# Altium schematic sheet MAIN2.SchDoc: Main Circuit
size 457 x 304 mm; DrawnBy: Daniel C. Salunga; SheetNumber: 1
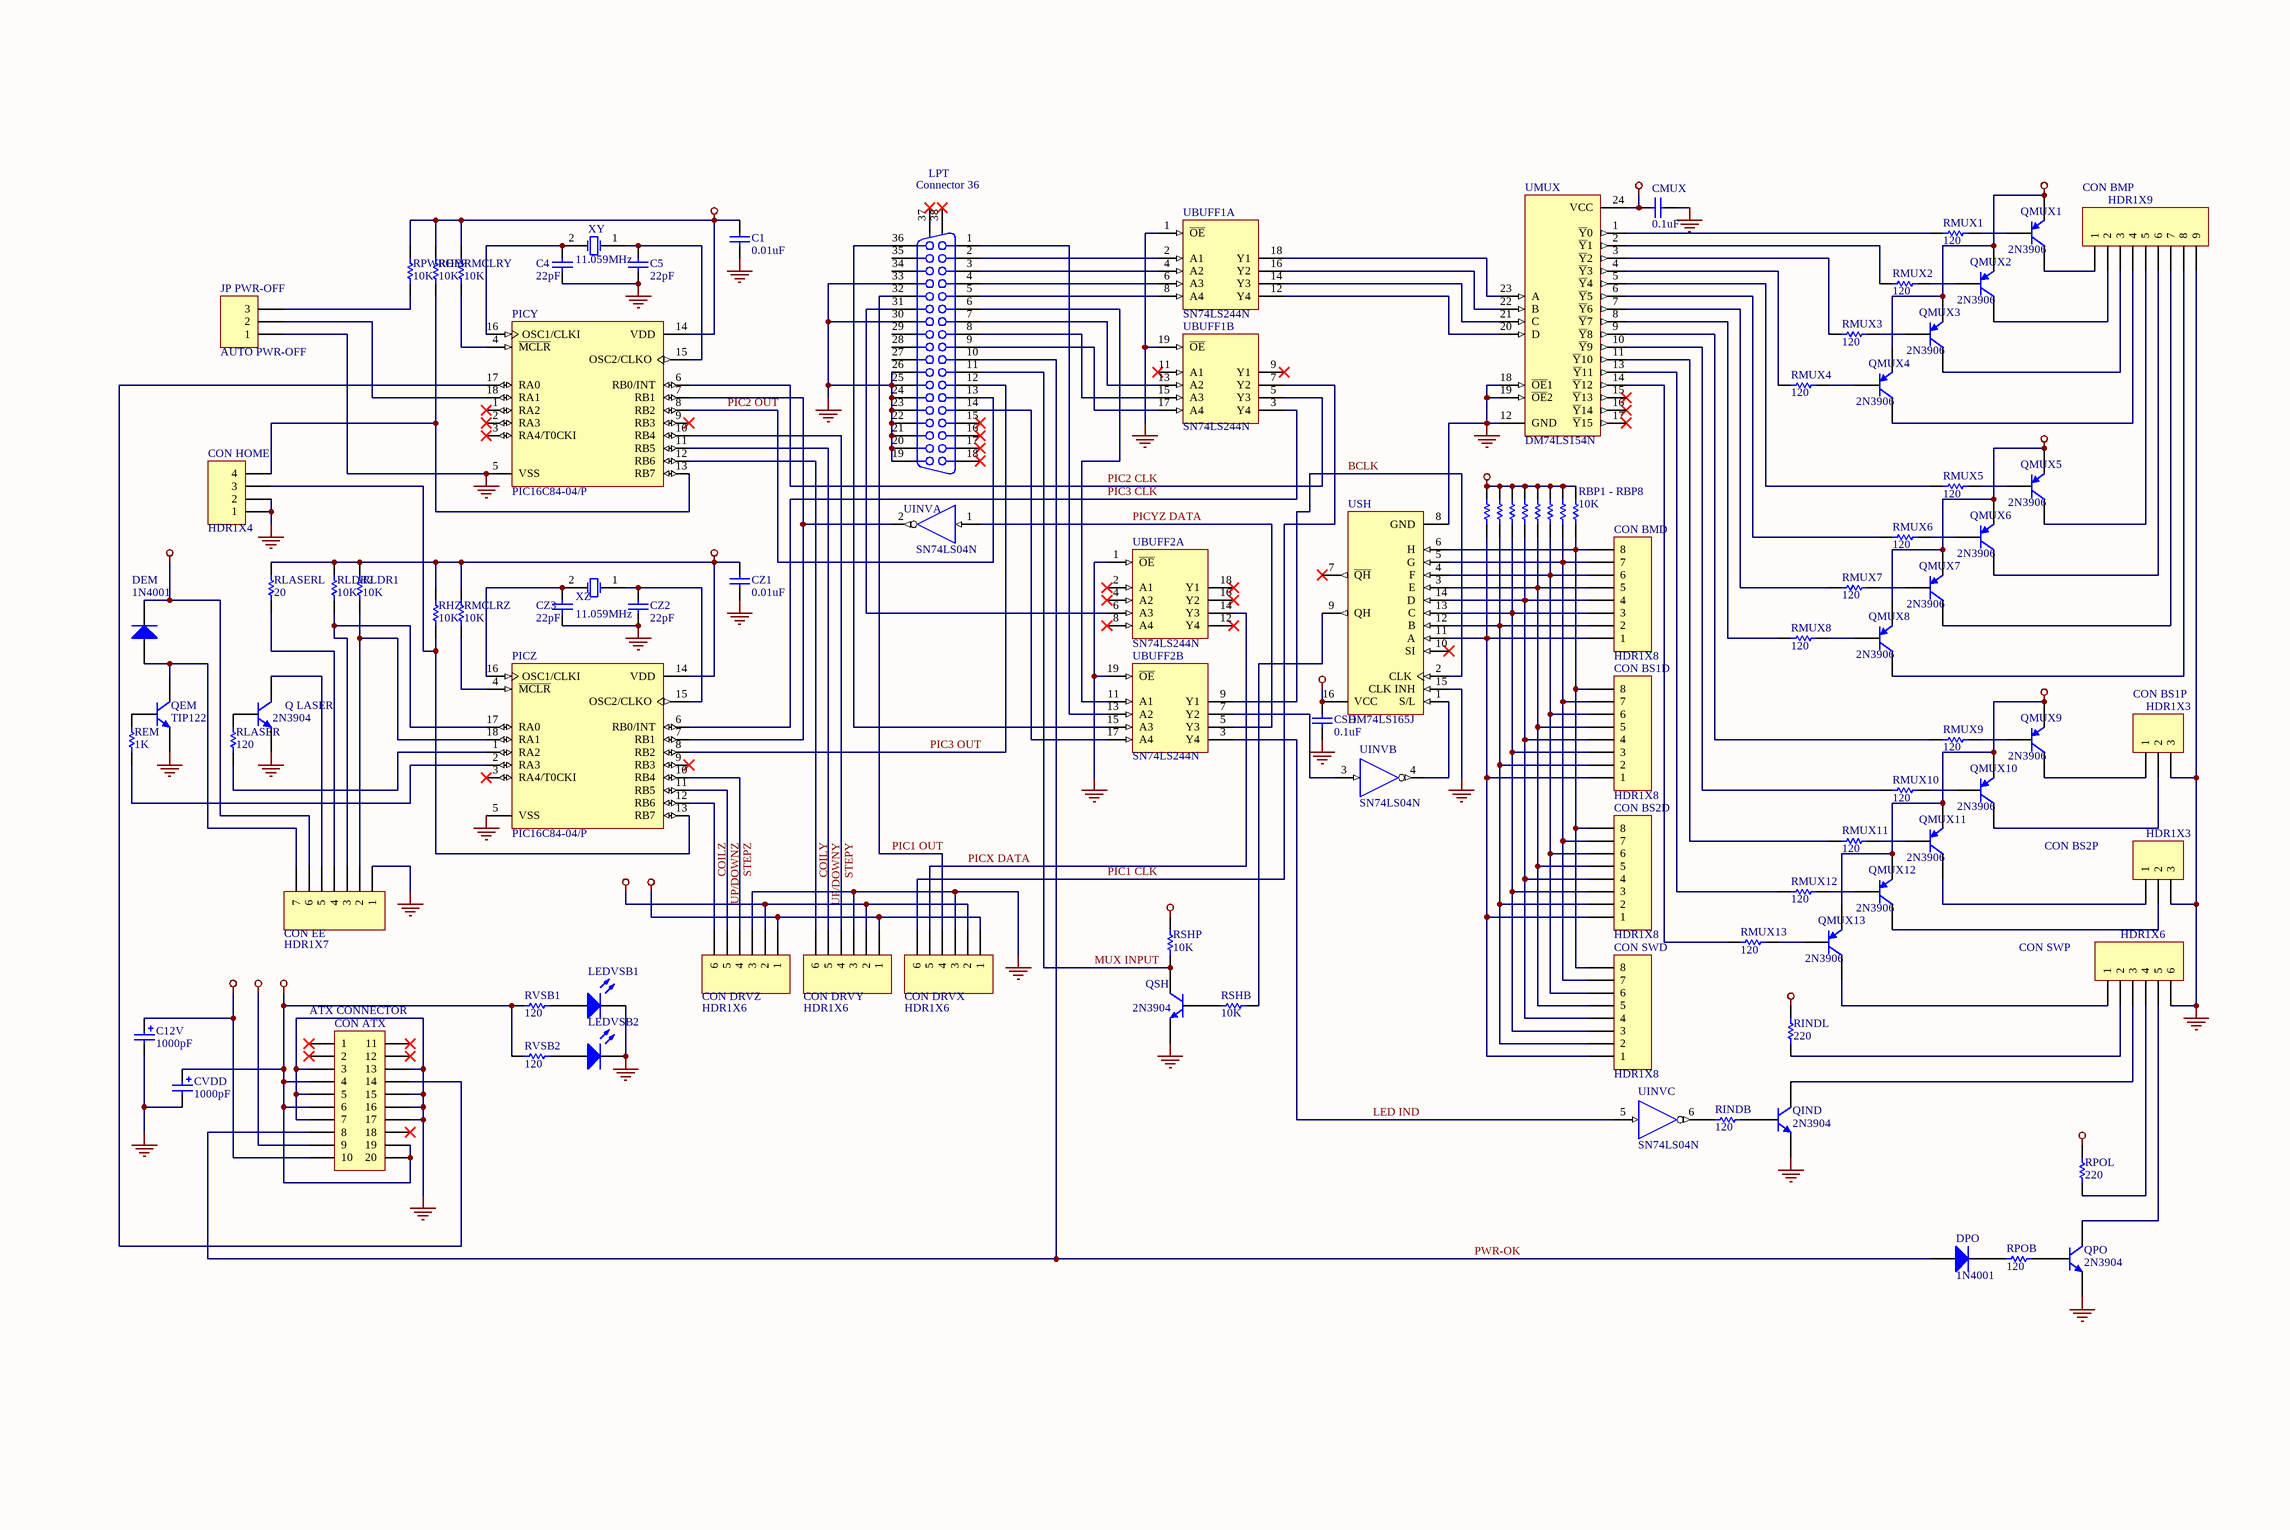
[diagram p0: MAIN2.SchDoc]

## Parts
C1  value 0.01uF  [C3216-1206]
C4  value 22pF  [C3216-1206]  (hidden comment: XTAL)
C5  value 22pF  [C3216-1206]  (hidden comment: XTAL)
C12V  value 1000pF  [RB5-10.5]
CMUX  value 0.1uF  [C3216-1206]
CON_ATX  ATX CONNECTOR  [HDR2X10_CEN]
CON_BMD  HDR1X8  [HDR1X8]
CON_BMP  HDR1X9  [HDR1X9]
CON_BS1D  HDR1X8  [HDR1X8]
CON_BS1P  HDR1X3  [HDR1X3]
CON_BS2D  HDR1X8  [HDR1X8]
CON_BS2P  HDR1X3  [HDR1X3]
CON_DRVX  HDR1X6  [HDR1X6]
CON_DRVY  HDR1X6  [HDR1X6]
CON_DRVZ  HDR1X6  [HDR1X6]
CON_EE  HDR1X7  [HDR1X7]
CON_HOME  HDR1X4  [HDR1X4]
CON_SWD  HDR1X8  [HDR1X8]
CON_SWP  HDR1X6  [HDR1X6]
CSH  value 0.1uF  [C3216-1206]
CVDD  value 1000pF  [RB5-10.5]
CZ1  value 0.01uF  [C3216-1206]
CZ2  value 22pF  [C3216-1206]  (hidden comment: XTAL)
CZ3  value 22pF  [C3216-1206]  (hidden comment: XTAL)
DEM  1N4001  [DIO10.46-5.3x2.8]
DPO  1N4001  [DIO10.46-5.3x2.8]
JP_PWR-OFF  AUTO PWR-OFF  [HDR1X3H]
LEDVSB1  (no value)  [DSO-F2/D6.1]
LEDVSB2  (no value)  [DSO-F2/D6.1]
LPT  Connector 36  [CHAMP1.27-2H36]
PICY  PIC16C84-04/P  [DIP-18]
PICZ  PIC16C84-04/P  [DIP-18]
Q_LASER  2N3904  [BCY-W3/D4.7]
QEM  TIP122  [SFM-T3/X1.6V]
QIND  2N3904  [BCY-W3/D4.7]
QMUX1  2N3906  [BCY-W3/D4.7]
QMUX2  2N3906  [BCY-W3/D4.7]
QMUX3  2N3906  [BCY-W3/D4.7]
QMUX4  2N3906  [BCY-W3/D4.7]
QMUX5  2N3906  [BCY-W3/D4.7]
QMUX6  2N3906  [BCY-W3/D4.7]
QMUX7  2N3906  [BCY-W3/D4.7]
QMUX8  2N3906  [BCY-W3/D4.7]
QMUX9  2N3906  [BCY-W3/D4.7]
QMUX10  2N3906  [BCY-W3/D4.7]
QMUX11  2N3906  [BCY-W3/D4.7]
QMUX12  2N3906  [BCY-W3/D4.7]
QMUX13  2N3906  [BCY-W3/D4.7]
QPO  2N3904  [BCY-W3]
QSH  2N3904  [BCY-W3/D4.7]
RBP1  Res1  [AXIAL-0.3]  (value not drawn)
RBP1_-_RBP8  value 10K  [AXIAL-0.3]  (hidden comment: Res1)
RBP2  Res1  [AXIAL-0.3]  (value not drawn)
RBP3  Res1  [AXIAL-0.3]  (value not drawn)
RBP4  Res1  [AXIAL-0.3]  (value not drawn)
RBP5  Res1  [AXIAL-0.3]  (value not drawn)
RBP6  Res1  [AXIAL-0.3]  (value not drawn)
RBP7  Res1  [AXIAL-0.3]  (value not drawn)
REM  value 1K  [AXIAL-0.3]
RHY  value 10K  [AXIAL-0.3]
RHZ  value 10K  [AXIAL-0.3]
RINDB  value 120  [AXIAL-0.3]
RINDL  value 220  [AXIAL-0.3]
RLASER  value 120  [AXIAL-0.3]
RLASERL  value 20  [AXIAL-0.3]
RLDR1  value 10K  [AXIAL-0.3]
RLDR2  value 10K  [AXIAL-0.3]
RMCLRY  value 10K  [AXIAL-0.3]
RMCLRZ  value 10K  [AXIAL-0.3]
RMUX1  value 120  [AXIAL-0.3]
RMUX2  value 120  [AXIAL-0.3]
RMUX3  value 120  [AXIAL-0.3]
RMUX4  value 120  [AXIAL-0.3]
RMUX5  value 120  [AXIAL-0.3]
RMUX6  value 120  [AXIAL-0.3]
RMUX7  value 120  [AXIAL-0.3]
RMUX8  value 120  [AXIAL-0.3]
RMUX9  value 120  [AXIAL-0.3]
RMUX10  value 120  [AXIAL-0.3]
RMUX11  value 120  [AXIAL-0.3]
RMUX12  value 120  [AXIAL-0.3]
RMUX13  value 120  [AXIAL-0.3]
RPOB  value 120  [AXIAL-0.3]
RPOL  value 220  [AXIAL-0.3]
RPWROFF  value 10K  [AXIAL-0.3]
RSHB  value 10K  [AXIAL-0.3]
RSHP  value 10K  [AXIAL-0.3]
RVSB1  value 120  [AXIAL-0.3]
RVSB2  value 120  [AXIAL-0.3]
UBUFF1  SN74LS244N  [DIP-20/E5.3]  (parts A,B of 2)
UBUFF2  SN74LS244N  [DIP-20/E5.3]  (parts A,B of 2)
UINV  SN74LS04N  [DIP-14/D19.7]  (parts A,B,C of 6)
UMUX  DM74LS154N  [DIP-24/D32.3]
USH  DM74LS165J  [DIP-16]
XY  11.059MHz  [BCY-W2/D3.1]
XZ  11.059MHz  [BCY-W2/D3.1]

## Nets
+12V: C12V.1 CON_ATX.10 CON_DRVX.1 CON_DRVY.1 CON_DRVZ.1 CON_EE.6 DEM.2(K)
GND: C1.1 C4.1 C5.1 C12V.2 CMUX.2 CON_ATX.3 CON_ATX.5 CON_ATX.7 CON_ATX.13 CON_ATX.15 CON_ATX.16 CON_ATX.17 CON_BMP.9 CON_BS1P.3 CON_BS2P.3 CON_DRVX.3 CON_DRVY.3 CON_DRVZ.3 CON_EE.1 CON_HOME.1 CON_HOME.2 CON_SWP.6 CSH.1 CVDD.2 CZ1.1 CZ2.1 CZ3.1 JP_PWR-OFF.1 LEDVSB1.2(K) LEDVSB2.2(K) LPT.19 LPT.20 LPT.21 LPT.22 LPT.23 LPT.24 LPT.25 LPT.26 LPT.30 LPT.33 PICY.5(VSS) PICZ.5(VSS) Q_LASER.1(E) QEM.3(E) QIND.1(E) QPO.3(E) QSH.1(E) UBUFF1.1(~{OE}) UBUFF1.10(GND) UBUFF1.19(~{OE}) UBUFF2.1(~{OE}) UBUFF2.10(GND) UBUFF2.19(~{OE}) UINV.7(GND) UMUX.12(GND) UMUX.18(~{OE}1) UMUX.19(~{OE}2) USH.8(GND) USH.15(CLK_INH)
VDD: CMUX.1 CON_ATX.4 CON_ATX.6 CON_ATX.19 CON_ATX.20 CON_DRVX.2 CON_DRVY.2 CON_DRVZ.2 CSH.2 CVDD.1 CZ1.2 PICZ.14(VDD) QMUX1.1(E) QMUX2.1(E) QMUX3.1(E) QMUX4.1(E) QMUX5.1(E) QMUX6.1(E) QMUX7.1(E) QMUX8.1(E) QMUX9.1(E) QMUX10.1(E) QMUX11.1(E) QMUX12.1(E) QMUX13.1(E) RBP1.2 RBP1_-_RBP8.2 RBP2.2 RBP3.2 RBP4.2 RBP5.2 RBP6.2 RBP7.2 RHZ.2 RINDL.2 RLASERL.2 RLDR1.2 RLDR2.2 RMCLRZ.2 RSHP.2 RVSB1.1 RVSB2.1 UBUFF1.20(VDD) UBUFF2.20(VDD) UINV.14(VDD) UMUX.24(VCC) USH.16(VCC)
VSB: C1.2 CON_ATX.9 PICY.14(VDD) RHY.2 RMCLRY.2 RPOL.2 RPWROFF.2
BCLK: UBUFF2.9(Y1) USH.2(CLK)
COILY: CON_DRVY.6 PICY.12(RB6)
COILZ: CON_DRVZ.6 PICZ.12(RB6)
LED IND: UBUFF2.3(Y4) UINV.5(IN)
MUX INPUT: LPT.11 QSH.3(C) RSHP.1
PIC1 CLK: CON_DRVX.6 UBUFF1.7(Y2)
PIC1 OUT: CON_DRVX.4 LPT.32
PIC2 CLK: PICY.6(RB0/INT) UBUFF1.5(Y3)
PIC2 OUT: LPT.13 PICY.8(RB2)
PIC3 CLK: PICZ.6(RB0/INT) UBUFF1.3(Y4)
PIC3 OUT: LPT.12 PICZ.8(RB2)
PICX DATA: CON_DRVX.5 UBUFF2.14(Y3)
PICYZ DATA: UBUFF2.5(Y3) UINV.1(IN)
PWR-OK: CON_ATX.8 DPO.1(A) LPT.10
STEPY: CON_DRVY.4 PICY.10(RB4)
STEPZ: CON_DRVZ.4 PICZ.10(RB4)
UP/DOWNY: CON_DRVY.5 PICY.11(RB5)
UP/DOWNZ: CON_DRVZ.5 PICZ.11(RB5)
NetC4_2: C4.2 PICY.16(OSC1/CLKI) XY.2(OSC2)
NetC5_2: C5.2 PICY.15(OSC2/CLKO) XY.1(OSC1)
NetCON_ATX_14: CON_ATX.14 PICY.17(RA0)
NetCON_BMD_1: CON_BMD.1 CON_BS1D.1 CON_BS2D.1 CON_SWD.1 RBP1.1 USH.11(A)
NetCON_BMD_2: CON_BMD.2 CON_BS1D.2 CON_BS2D.2 CON_SWD.2 RBP2.1 USH.12(B)
NetCON_BMD_3: CON_BMD.3 CON_BS1D.3 CON_BS2D.3 CON_SWD.3 RBP3.1 USH.13(C)
NetCON_BMD_4: CON_BMD.4 CON_BS1D.4 CON_BS2D.4 CON_SWD.4 RBP4.1 USH.14(D)
NetCON_BMD_5: CON_BMD.5 CON_BS1D.5 CON_BS2D.5 CON_SWD.5 RBP5.1 USH.3(E)
NetCON_BMD_6: CON_BMD.6 CON_BS1D.6 CON_BS2D.6 CON_SWD.6 RBP6.1 USH.4(F)
NetCON_BMD_7: CON_BMD.7 CON_BS1D.7 CON_BS2D.7 CON_SWD.7 RBP7.1 USH.5(G)
NetCON_BMD_8: CON_BMD.8 CON_BS1D.8 CON_BS2D.8 CON_SWD.8 RBP1_-_RBP8.1 USH.6(H)
NetCON_BMP_1: CON_BMP.1 QMUX1.3(C)
NetCON_BMP_2: CON_BMP.2 QMUX2.3(C)
NetCON_BMP_3: CON_BMP.3 QMUX3.3(C)
NetCON_BMP_4: CON_BMP.4 QMUX4.3(C)
NetCON_BMP_5: CON_BMP.5 QMUX5.3(C)
NetCON_BMP_6: CON_BMP.6 QMUX6.3(C)
NetCON_BMP_7: CON_BMP.7 QMUX7.3(C)
NetCON_BMP_8: CON_BMP.8 QMUX8.3(C)
NetCON_BS1P_1: CON_BS1P.1 QMUX9.3(C)
NetCON_BS1P_2: CON_BS1P.2 QMUX10.3(C)
NetCON_BS2P_1: CON_BS2P.1 QMUX11.3(C)
NetCON_BS2P_2: CON_BS2P.2 QMUX12.3(C)
NetCON_EE_2: CON_EE.2 PICZ.18(RA1) RLDR1.1
NetCON_EE_3: CON_EE.3 PICZ.17(RA0) RLDR2.1
NetCON_EE_4: CON_EE.4 RLASERL.1
NetCON_EE_5: CON_EE.5 Q_LASER.3(C)
NetCON_EE_7: CON_EE.7 DEM.1(A) QEM.2(C)
NetCON_HOME_3: CON_HOME.3 PICZ.13(RB7) RHZ.1
NetCON_HOME_4: CON_HOME.4 PICY.13(RB7) RHY.1
NetCON_SWP_1: CON_SWP.1 QMUX13.3(C)
NetCON_SWP_2: CON_SWP.2 RINDL.1
NetCON_SWP_3: CON_SWP.3 QIND.3(C)
NetCON_SWP_4: CON_SWP.4 RPOL.1
NetCON_SWP_5: CON_SWP.5 QPO.1(C)
NetCZ2_2: CZ2.2 PICZ.15(OSC2/CLKO) XZ.1(OSC1)
NetCZ3_2: CZ3.2 PICZ.16(OSC1/CLKI) XZ.2(OSC2)
NetDPO_2: DPO.2(K) RPOB.1
NetJP_PWR-OFF_2: JP_PWR-OFF.2 PICY.18(RA1)
NetJP_PWR-OFF_3: JP_PWR-OFF.3 RPWROFF.1
NetLEDVSB1_1: LEDVSB1.1(A) RVSB1.2
NetLEDVSB2_1: LEDVSB2.1(A) RVSB2.2
NetLPT_1: LPT.1 UBUFF2.13(A2)
NetLPT_2: LPT.2 UBUFF1.2(A1)
NetLPT_3: LPT.3 UBUFF1.4(A2)
NetLPT_4: LPT.4 UBUFF1.6(A3)
NetLPT_5: LPT.5 UBUFF1.8(A4)
NetLPT_6: LPT.6 UBUFF2.11(A1)
NetLPT_7: LPT.7 UBUFF1.13(A2)
NetLPT_8: LPT.8 UBUFF1.15(A3)
NetLPT_9: LPT.9 UBUFF1.17(A4)
NetLPT_14: LPT.14 UBUFF2.17(A4)
NetLPT_31: LPT.31 UBUFF2.6(A3)
NetLPT_36: LPT.36 UBUFF2.15(A3)
NetPICY_4: PICY.4(~{MCLR}) RMCLRY.1
NetPICY_7: PICY.7(RB1) PICZ.7(RB1) UINV.2(~{OUT})
NetPICZ_1: PICZ.1(RA2) RLASER.1
NetPICZ_2: PICZ.2(RA3) REM.1
NetPICZ_4: PICZ.4(~{MCLR}) RMCLRZ.1
NetQ_LASER_2: Q_LASER.2(B) RLASER.2
NetQEM_1: QEM.1(B) REM.2
NetQIND_2: QIND.2(B) RINDB.2
NetQMUX1_2: QMUX1.2(B) RMUX1.2
NetQMUX2_2: QMUX2.2(B) RMUX2.2
NetQMUX3_2: QMUX3.2(B) RMUX3.2
NetQMUX4_2: QMUX4.2(B) RMUX4.2
NetQMUX5_2: QMUX5.2(B) RMUX5.2
NetQMUX6_2: QMUX6.2(B) RMUX6.2
NetQMUX7_2: QMUX7.2(B) RMUX7.2
NetQMUX8_2: QMUX8.2(B) RMUX8.2
NetQMUX9_2: QMUX9.2(B) RMUX9.2
NetQMUX10_2: QMUX10.2(B) RMUX10.2
NetQMUX11_2: QMUX11.2(B) RMUX11.2
NetQMUX12_2: QMUX12.2(B) RMUX12.2
NetQMUX13_2: QMUX13.2(B) RMUX13.2
NetQPO_2: QPO.2(B) RPOB.2
NetQSH_2: QSH.2(B) RSHB.1
NetRINDB_1: RINDB.1 UINV.6(~{OUT})
NetRMUX1_1: RMUX1.1 UMUX.1(~{Y}0)
NetRMUX2_1: RMUX2.1 UMUX.2(~{Y}1)
NetRMUX3_1: RMUX3.1 UMUX.3(~{Y}2)
NetRMUX4_1: RMUX4.1 UMUX.4(~{Y}3)
NetRMUX5_1: RMUX5.1 UMUX.5(~{Y}4)
NetRMUX6_1: RMUX6.1 UMUX.6(~{Y}5)
NetRMUX7_1: RMUX7.1 UMUX.7(~{Y}6)
NetRMUX8_1: RMUX8.1 UMUX.8(~{Y}7)
NetRMUX9_1: RMUX9.1 UMUX.9(~{Y}8)
NetRMUX10_1: RMUX10.1 UMUX.10(~{Y}9)
NetRMUX11_1: RMUX11.1 UMUX.11(~{Y}10)
NetRMUX12_1: RMUX12.1 UMUX.13(~{Y}11)
NetRMUX13_1: RMUX13.1 UMUX.14(~{Y}12)
NetRSHB_2: RSHB.2 USH.9(QH)
NetUBUFF1_12: UBUFF1.12(Y4) UMUX.20(D)
NetUBUFF1_14: UBUFF1.14(Y3) UMUX.21(C)
NetUBUFF1_16: UBUFF1.16(Y2) UMUX.22(B)
NetUBUFF1_18: UBUFF1.18(Y1) UMUX.23(A)
NetUBUFF2_7: UBUFF2.7(Y2) UINV.3(IN)
NetUINV_4: UINV.4(~{OUT}) USH.1(S/L)

Not connected (* = marked no-connect by the designer): CON_ATX 1* 2* 11* 12* 18*; LPT 15* 16* 17* 18* 27 28 29 34 35 37(MH1)* 38(MH2)*; PICY 1(RA2)* 2(RA3)* 3(RA4/T0CKI)* 9(RB3)*; PICZ 3(RA4/T0CKI)* 9(RB3)*; UBUFF1 9(Y1)* 11(A1)*; UBUFF2 2(A1)* 4(A2)* 8(A4)* 12(Y4)* 16(Y2)* 18(Y1)*; UMUX 15(~{Y}13)* 16(~{Y}14)* 17(~{Y}15)*; USH 7(~{QH})* 10(SI)*

## Library data of the parts
C1 CMUX CSH CZ1 = Cap Semi: Capacitor (Semiconductor SIM Model); Manufacturer: Generic Components; Class I: Passive; Published: 8-Jun-2000; Revision: July-2002: Re-released for DXP Platform.; Publisher: Altium Limited; Class II: Capacitor
C4 C5 CZ2 CZ3 = cap: Capacitor; Manufacturer: Generic Components; Class I: Passive; Published: 8-Jun-2000; Revision: July-2002: Re-released for DXP Platform.; Publisher: Altium Limited; Class II: Capacitor
C12V CVDD = Cap Pol1: Polarized Capacitor (Radial); Manufacturer: Generic Components; Class I: Passive; Published: 8-Jun-2000; Revision: July-2002: Re-released for DXP Platform.; Publisher: Altium Limited; Class II: Capacitor
CON_ATX = Header 10X2A: Header, 10-Pin, Dual row; Manufacturer: Generic Components; Revision: July-2002: Re-released for DXP Platform.; Publisher: Altium Limited; Class I: Connector
CON_BMD CON_BS1D CON_BS2D CON_SWD = MHDR1X8: Header, 8-Pin; Manufacturer: Generic Components; Class I: Connector; Revision: July-2002: Re-released for DXP Platform.; Publisher: Altium Limited
CON_BMP = MHDR1X9: Header, 9-Pin; Manufacturer: Generic Components; Class I: Connector; Revision: July-2002: Re-released for DXP Platform.; Publisher: Altium Limited
CON_BS1P CON_BS2P = MHDR1X3: Header, 3-Pin; Manufacturer: Generic Components; Class I: Connector; Revision: July-2002: Re-released for DXP Platform.; Publisher: Altium Limited
CON_DRVX CON_DRVY CON_DRVZ CON_SWP = MHDR1X6: Header, 6-Pin; Manufacturer: Generic Components; Class I: Connector; Revision: July-2002: Re-released for DXP Platform.; Publisher: Altium Limited
CON_EE = MHDR1X7: Header, 7-Pin; Manufacturer: Generic Components; Class I: Connector; Revision: July-2002: Re-released for DXP Platform.; Publisher: Altium Limited
CON_HOME = MHDR1X4: Header, 4-Pin; Manufacturer: Generic Components; Class I: Connector; Revision: July-2002: Re-released for DXP Platform.; Publisher: Altium Limited
DEM DPO = 1N4001: 1.0 Ampere General Purpose Rectifier; Manufacturer: Fairchild Semiconductor; Revision 1: 11-July-2000: SIM Model Added.; Revision 2: July-2002: Re-released for DXP Platform.; Package Information: Latest Revision: Aug-1999; Class I: Discrete; Class II: Rectifier - Standard Recovery; Published: 8-Jun-2000; Datasheet: Latest Revision: 1998; Package Reference: DO-41; Publisher: Altium Limited
JP_PWR-OFF = Header 3H: Header, 3-Pin,  Right Angle; Manufacturer: Generic Components; Class I: Connector; Revision: July-2002: Re-released for DXP Platform.; Publisher: Altium Limited
LEDVSB1 LEDVSB2 = LED2: Typical RED, GREEN, YELLOW, AMBER GaAs LED; Manufacturer: Generic Components; Class I: Optoelectronic; Published: 8-Jun-2000; Revision: July-2002: Re-released for DXP Platform.; Publisher: Altium Limited; Class II: LED
LPT = Connector 36: Receptacle Header Assemby; Manufacturer: Generic Components; Package Information: Latest Revision: B; Positions: 36; Published: 15-Jun-2001; Revision: July-2002: Re-released for DXP Platform.; Datasheet: (1-Oct-1983); Package Reference: 178240; Publisher: Altium Limited; Class I: Connector; Orientation: Right Angle
PICY PICZ = PIC16C84-04/P: EPROM-Based 8-Bit CMOS Microcontroller; Manufacturer: Microchip; Published: 8-Jun-2000; Revision: July-2002: Re-released for DXP Platform.; Datasheet: 1997 Technical Library CD (1996); Package Reference: P18A; Publisher: Altium Limited; Class I: Microcontroller; Class II: 8-bit
Q_LASER QIND QSH = 2N3904: NPN General Purpose Amplifier; Manufacturer: Generic Components; Revision 1: 11-July-2000: SIM Model Added.; Revision 2: July-2002: Re-released for DXP Platform.; Class I: Discrete; Class II: BJT - Low Power; Published: 8-Jun-2000; Datasheet: Latest Revision: 1997; Package Reference: TO-92A; Publisher: Altium Limited
QEM = MJE15030: Complementary Silicon Plastic Power Transistor; Manufacturer: Motorola; Package Information: Latest Revision: 1997; Class I: Discrete; Class II: BJT - Medium Power; Note: Pin 2 is electrically connected to Pin 4 (TAB); Published: 29-Sep-2000; Revision: July-2002: Re-released for DXP Platform.; Datasheet: Latest Revision: 1995; Package Reference: 221A-06; Publisher: Altium Limited
QMUX1-QMUX13 = 2N3906: PNP General Purpose Amplifier; Manufacturer: Generic Components; Revision 1: 11-July-2000: SIM Model Added.; Revision 2: July-2002: Re-released for DXP Platform.; Class I: Discrete; Class II: BJT - Low Power; Published: 8-Jun-2000; Datasheet: Latest Revision: 1997; Package Reference: TO-92A; Publisher: Altium Limited
QPO = NPN: NPN Bipolar Transistor; Manufacturer: Generic Components; Class I: Discrete; Class II: BJT - Low Power; Published: 8-Jun-2000; Revision: July-2002: Re-released for DXP Platform.; Publisher: Altium Limited
RBP1-RBP7 = Res1: Resistor; Manufacturer: Generic Components; Class I: Passive; Value: 10K; Published: 8-Jun-2000; Revision: July-2002: Re-released for DXP Platform.; Publisher: Altium Limited; Class II: Resistor
RBP1_-_RBP8 REM RHY RHZ RINDB RINDL RLASER RLASERL RLDR1 RLDR2 RMCLRY RMCLRZ RMUX1-RMUX13 RPOB RPOL RPWROFF RSHB RSHP RVSB1 RVSB2 = Res1: Resistor; Manufacturer: Generic Components; Class I: Passive; Published: 8-Jun-2000; Revision: July-2002: Re-released for DXP Platform.; Publisher: Altium Limited; Class II: Resistor
UBUFF1 UBUFF2 = SN74LS244N: Octal Buffer/Line Driver with 3-State Outputs; Manufacturer: ON Semiconductor; Class I: Logic; Published: 15-Apr-2002; Package Reference: 738-03; Publisher: Altium Limited; Class II: Buffer/Line Driver
UINV = SN74LS04N: Hex Inverter; Manufacturer: ON Semiconductor; Class I: Logic; Class II: Buffer/Line Driver; Published: 15-Apr-2002; Datasheet: Latest Revision: 1999; Package Reference: 646-06; Publisher: Altium Limited
UMUX = DM74LS154N: 4-Line to 16-Line Decoder/Demultiplexer; Manufacturer: Fairchild Semiconductor; Class I: Logic; Note: Generic Simulation model provided.; Published: 15-Apr-2002; Datasheet: Latest Revision: Mar-1998; Package Reference: N24A; Publisher: Altium Limited; Class II: Decoder/Demultiplexer
USH = DM74LS165J: 8-Bit Parallel In/Serial Output Shift Register; Manufacturer: Fairchild Semiconductor; Class I: Logic; Note: Generic simulation model provided.; Published: 15-Apr-2002; Datasheet: Latest Revision: Apr-1998; Package Reference: J16A; Publisher: Altium Limited; Class II: Register
XY XZ = XTAL: Crystal Oscillator; Manufacturer: Generic Components; Published: 8-Jun-2000; Revision: July-2002: Re-released for DXP Platform.; Publisher: Altium Limited; Class I: Oscillator; Class II: Crystal Oscillator